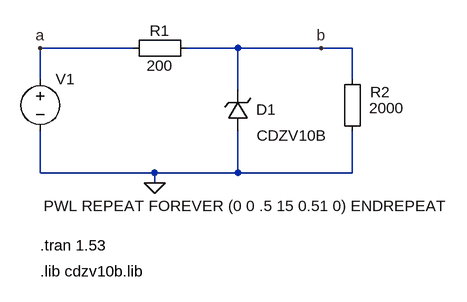
[diagram p0: schematic PL-P3.asc]
PL-P3.asc, the LTspice schematic file:
Version 4
SHEET 1 880 680
WIRE 16 112 -128 112
WIRE 176 112 96 112
WIRE 304 112 176 112
WIRE 352 112 304 112
WIRE -128 160 -128 112
WIRE 352 160 352 112
WIRE 176 176 176 112
WIRE -128 304 -128 240
WIRE 48 304 -128 304
WIRE 176 304 176 240
WIRE 176 304 48 304
WIRE 352 304 352 240
WIRE 352 304 176 304
WIRE 48 320 48 304
FLAG -128 112 a
FLAG 304 112 b
FLAG 48 320 0
SYMBOL Misc\\EuropeanResistor 112 96 R90
WINDOW 0 5 56 VBottom 2
WINDOW 3 27 56 VTop 2
SYMATTR InstName R1
SYMATTR Value 200
SYMBOL zener 192 240 R180
WINDOW 0 -43 33 Left 2
WINDOW 3 -121 -7 Left 2
SYMATTR InstName D1
SYMATTR Value CDZV10B
SYMATTR Description Diode
SYMATTR Type diode
SYMBOL Misc\\EuropeanResistor 368 256 R180
WINDOW 0 -42 76 Left 2
WINDOW 3 -64 52 Left 2
SYMATTR InstName R2
SYMATTR Value 2000
SYMBOL voltage -128 144 R0
WINDOW 3 5 211 Left 2
WINDOW 123 0 0 Left 2
WINDOW 39 0 0 Left 2
SYMATTR Value PWL REPEAT FOREVER (0 0 .5 15 0.51 0) ENDREPEAT
SYMATTR InstName V1
TEXT -128 416 Left 2 !.tran 1.53
TEXT -128 456 Left 2 !.lib cdzv10b.lib

The netlist it stands for:
* PL-P3.asc
R1 b a 200
D1 0 b CDZV10B
R2 0 b 2000
V1 a 0 PWL REPEAT FOREVER (0 0 .5 15 0.51 0) ENDREPEAT
.model D D
.lib standard.dio
.tran 1.53
.lib cdzv10b.lib
.backanno
.end